# EAGLE design lcd_backpack_v1 (EAGLE 5.07)
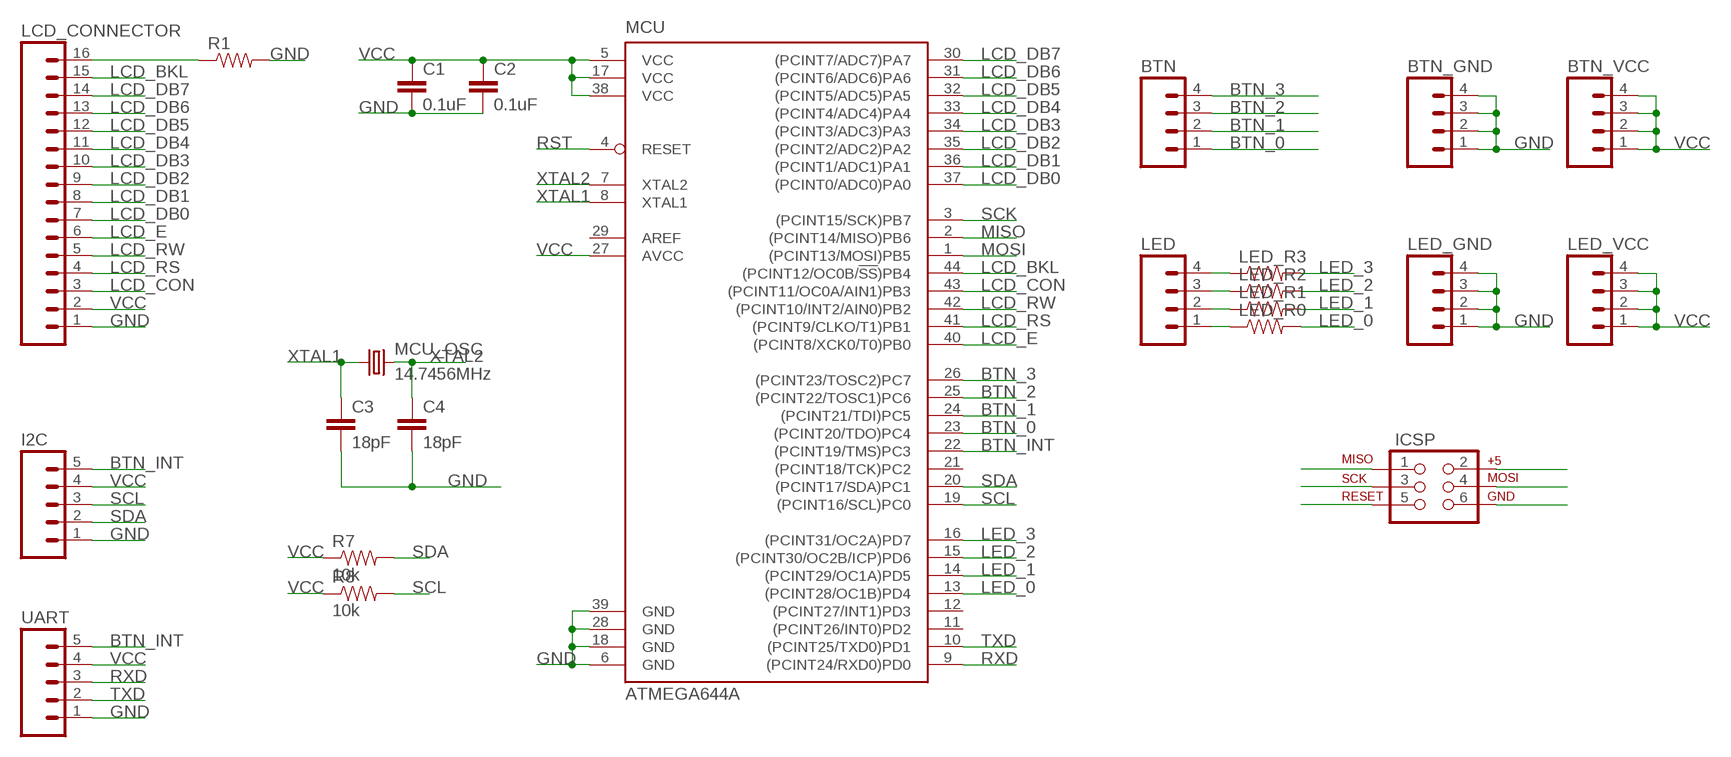
[diagram p0: schematic, sheet 1]

## Parts
BTN  M04PTH  [1X04]
BTN_GND  M04PTH  [1X04]
BTN_VCC  M04PTH  [1X04]
C1  0.1uF  CAP0603-CAP  [0603-CAP]
C2  0.1uF  CAP0603-CAP  [0603-CAP]
C3  18pF  CAP0603-CAP  [0603-CAP]
C4  18pF  CAP0603-CAP  [0603-CAP]
I2C  M05PTH  [1X05]
ICSP  AVR_SPI_PRG_6PTH  [2X3]
LCD_CONNECTOR  M16LONGPADS  [1X16_LONGPADS]
LED  M04PTH  [1X04]
LED_GND  M04PTH  [1X04]
LED_R0  RESISTOR0603-RES  [0603-RES]
LED_R1  RESISTOR0603-RES  [0603-RES]
LED_R2  RESISTOR0603-RES  [0603-RES]
LED_R3  RESISTOR0603-RES  [0603-RES]
LED_VCC  M04PTH  [1X04]
MCU  ATMEGA644A  [TQFP44]
MCU_OSC  14.7456MHz  CRYSTAL5X3  [CRYSTAL-SMD-5X3]
R1  RESISTOR0603-RES  [0603-RES]
R7  10k  RESISTOR0603-RES  [0603-RES]
R8  10k  RESISTOR0603-RES  [0603-RES]
UART  M05PTH  [1X05]

## Nets
BTN_0: BTN.1 MCU.23((PCINT20/TDO)PC4)
BTN_1: BTN.2 MCU.24((PCINT21/TDI)PC5)
BTN_2: BTN.3 MCU.25((PCINT22/TOSC1)PC6)
BTN_3: BTN.4 MCU.26((PCINT23/TOSC2)PC7)
BTN_INT: I2C.5 MCU.22((PCINT19/TMS)PC3) UART.5
GND [supply]: BTN_GND.1 BTN_GND.2 BTN_GND.3 BTN_GND.4 C1.2 C2.2 C3.2 C4.2 I2C.1 ICSP.6 LCD_CONNECTOR.1 LED_GND.1 LED_GND.2 LED_GND.3 LED_GND.4 MCU.6(GND) MCU.18(GND) MCU.28(GND) MCU.39(GND) R1.2 UART.1
LCD_BKL: LCD_CONNECTOR.15 MCU.44((PCINT12/OC0B/!SS!)PB4)
LCD_CON: LCD_CONNECTOR.3 MCU.43((PCINT11/OC0A/AIN1)PB3)
LCD_DB0: LCD_CONNECTOR.7 MCU.37((PCINT0/ADC0)PA0)
LCD_DB1: LCD_CONNECTOR.8 MCU.36((PCINT1/ADC1)PA1)
LCD_DB2: LCD_CONNECTOR.9 MCU.35((PCINT2/ADC2)PA2)
LCD_DB3: LCD_CONNECTOR.10 MCU.34((PCINT3/ADC3)PA3)
LCD_DB4: LCD_CONNECTOR.11 MCU.33((PCINT4/ADC4)PA4)
LCD_DB5: LCD_CONNECTOR.12 MCU.32((PCINT5/ADC5)PA5)
LCD_DB6: LCD_CONNECTOR.13 MCU.31((PCINT6/ADC6)PA6)
LCD_DB7: LCD_CONNECTOR.14 MCU.30((PCINT7/ADC7)PA7)
LCD_E: LCD_CONNECTOR.6 MCU.40((PCINT8/XCK0/T0)PB0)
LCD_RS: LCD_CONNECTOR.4 MCU.41((PCINT9/CLKO/T1)PB1)
LCD_RW: LCD_CONNECTOR.5 MCU.42((PCINT10/INT2/AIN0)PB2)
LED_0: LED_R0.2 MCU.13((PCINT28/OC1B)PD4)
LED_1: LED_R1.2 MCU.14((PCINT29/OC1A)PD5)
LED_2: LED_R2.2 MCU.15((PCINT30/OC2B/ICP)PD6)
LED_3: LED_R3.2 MCU.16((PCINT31/OC2A)PD7)
MISO: ICSP.1 MCU.2((PCINT14/MISO)PB6)
MOSI: ICSP.4 MCU.1((PCINT13/MOSI)PB5)
N$1: LED.1 LED_R0.1
N$2: LED.2 LED_R1.1
N$3: LED.3 LED_R2.1
N$4: LED.4 LED_R3.1
N$9: LCD_CONNECTOR.16 R1.1
RST: ICSP.5 MCU.4(RESET)
RXD: MCU.9((PCINT24/RXD0)PD0) UART.3
SCK: ICSP.3 MCU.3((PCINT15/SCK)PB7)
SCL: I2C.3 MCU.19((PCINT16/SCL)PC0) R8.2
SDA: I2C.2 MCU.20((PCINT17/SDA)PC1) R7.2
TXD: MCU.10((PCINT25/TXD0)PD1) UART.2
VCC [supply]: BTN_VCC.1 BTN_VCC.2 BTN_VCC.3 BTN_VCC.4 C1.1 C2.1 I2C.4 ICSP.2 LCD_CONNECTOR.2 LED_VCC.1 LED_VCC.2 LED_VCC.3 LED_VCC.4 MCU.5(VCC) MCU.17(VCC) MCU.27(AVCC) MCU.38(VCC) R7.1 R8.1 UART.4
XTAL1: C3.1 MCU.8(XTAL1) MCU_OSC.1
XTAL2: C4.1 MCU.7(XTAL2) MCU_OSC.3
Unconnected: MCU.11((PCINT26/INT0)PD2) MCU.12((PCINT27/INT1)PD3) MCU.21((PCINT18/TCK)PC2) MCU.29(AREF)

## Library data of the parts
BTN BTN_GND BTN_VCC LED LED_GND LED_VCC = SparkFun:M04: Header 4 Standard 4-pin 0.1" header. Use with straight break away headers (SKU : PRT-00116), right angle break away headers (PRT-00553), swiss pins (PRT-00743), machine pins (PRT-00117), and female headers (PRT-00115). Molex polarized connector foot print use with SKU : PRT-08231 with associated crimp pins and housings.
C1-C4 = SparkFun:CAP: Capacitor Standard 0603 ceramic capacitor, and 0.1" leaded capacitor.
I2C UART = SparkFun:M05: Header 5 Standard 5-pin 0.1" header. Use with straight break away headers (SKU : PRT-00116), right angle break away headers (PRT-00553), swiss pins (PRT-00743), machine pins (PRT-00117), and female headers (PRT-00115). Molex polarized connector foot print use with SKU : PRT-08230 with associated crimp pins and housings.
ICSP = SparkFun:AVR_SPI_PRG_6: AVR ISP 6 Pin This is the reduced ISP connector for AVR programming. Common on Arduino. This footprint will take up less PCB space and can be used with a 10-pin to 6-pin adapter such as SKU: BOB-08508
LCD_CONNECTOR = SparkFun:M16
LED_R0 LED_R1-LED_R3 R1 R7 R8 = SparkFun:RESISTOR: Resistor Basic schematic elements and footprints for 0603, 1206, and PTH 1/10th watt (small) resistors.
MCU = atmel:ATMEGA644: 8-bit Microcontroller with 64K Bytes In-System Programmable Flash Source: http://www.atmel.com/dyn/resources/prod_documents/doc2593.pdf
MCU_OSC = SparkFun:CRYSTAL: Crystals Various standard crystals. Proven footprints. Spark Fun Electronics SKU : COM-00534

## Net classes
0 signal: width 0.152 mm
1 supply: width 0.305 mm

## Board
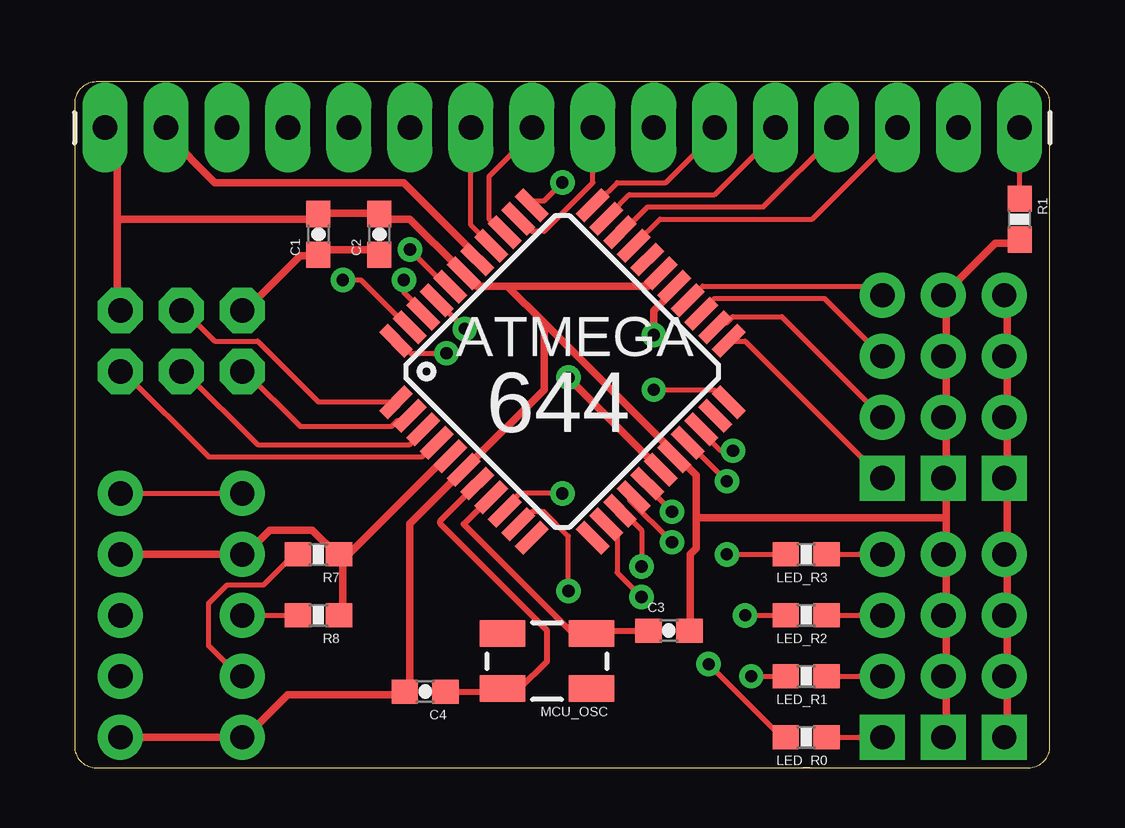
[diagram p1: board, top side]
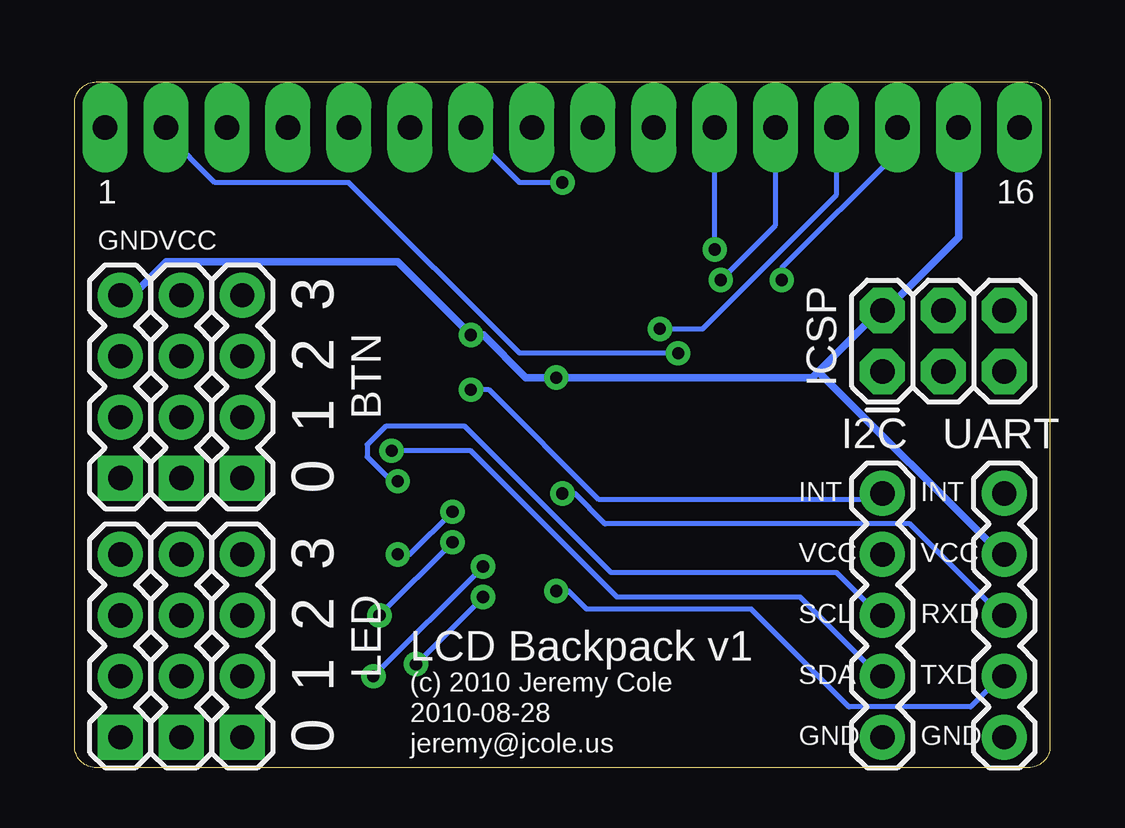
[diagram p2: board, bottom side, seen from below]

Size 40.64 x 28.57 mm. Coordinates in mm from the lower left corner, seen from the top.
Outline: 39.74,0 arc90 40.64,0.9 40.64,27.68 arc90 39.74,28.57 0.9,28.57 arc90 0,27.68 0,0.9 arc90 0.9,0 39.74,0
Copper layers (1*16): Top 0.035mm / dielectric 1.5mm / Bottom 0.035mm
Design rules "SparkFun": minimum track width 8mil, minimum drill 20mil, track to track 8mil, track to pad 8mil, pad to pad 8mil, via to via 8mil, smd to smd 8mil, copper to edge 10mil, drill to drill 8mil, minimum pad ring 12mil, minimum via ring 10mil, stop-mask expansion 4mil, vias tented up to drill 25mil, thermal gap 10mil
tRestrict: area 16.5,2.5 to 22.9,6.3
bRestrict: area 16.5,2.5 to 22.9,6.3

### Footprints (pad centres in the part's own frame; a part is rotated, then mirrored left to right if it is on the bottom)
1X04 = drill 1.016 pad 1.88 square: 1 0,0 | drill 1.016 pad 1.88 round: 2 2.54,0; 3 5.08,0; 4 7.62,0
0603-CAP = smd 1.1 x 1: 1 -0.85,0; 2 0.85,0
1X05 = drill 1.016 pad 1.88 round: 1 0,0; 2 2.54,0; 3 5.08,0; 4 7.62,0; 5 10.16,0
2X3 = drill 1.016 pad 1.88 octagon: 1 0,0; 2 0,2.54; 3 2.54,0; 4 2.54,2.54; 5 5.08,0; 6 5.08,2.54
1X16_LONGPADS = drill 1.016 pad 1.88 long: 1 0,0; 2 2.54,0; 3 5.08,0; 4 7.62,0; 5 10.16,0; 6 12.7,0; 7 15.24,0; 8 17.78,0; 9 20.32,0; 10 22.86,0; 11 25.4,0; 12 27.94,0; 13 30.48,0; 14 33.02,0; 15 35.56,0; 16 38.1,0
0603-RES = smd 1.1 x 1: 1 -0.85,0; 2 0.85,0
TQFP44 = smd 1.5 x 0.5: 1 -5.8,4; 2 -5.8,3.2; 3 -5.8,2.4; 4 -5.8,1.6; 5 -5.8,0.8; 6 -5.8,0; 7 -5.8,-0.8; 8 -5.8,-1.6; 9 -5.8,-2.4; 10 -5.8,-3.2; 11 -5.8,-4; 23 5.8,-4; 24 5.8,-3.2; 25 5.8,-2.4; 26 5.8,-1.6; 27 5.8,-0.8; 28 5.8,0; 29 5.8,0.8; 30 5.8,1.6; 31 5.8,2.4; 32 5.8,3.2; 33 5.8,4 | smd 0.5 x 1.5: 12 -4,-5.8; 13 -3.2,-5.8; 14 -2.4,-5.8; 15 -1.6,-5.8; 16 -0.8,-5.8; 17 0,-5.8; 18 0.8,-5.8; 19 1.6,-5.8; 20 2.4,-5.8; 21 3.2,-5.8; 22 4,-5.8; 34 4,5.8; 35 3.2,5.8; 36 2.4,5.8; 37 1.6,5.8; 38 0.8,5.8; 39 0,5.8; 40 -0.8,5.8; 41 -1.6,5.8; 42 -2.4,5.8; 43 -3.2,5.8; 44 -4,5.8
CRYSTAL-SMD-5X3 = smd 1.9 x 1.1: 1 -1.85,-1.15; 2 1.85,-1.15; 3 1.85,1.15; 4 -1.85,1.15

### Placement (x,y rotation side)
BTN  33.66,12.06 90 bottom
BTN_GND  36.2,12.06 90 bottom
BTN_VCC  38.73,12.06 90 bottom
C1  10.16,22.23 90 top
C2  12.7,22.23 90 top
C3  24.77,5.71 0 top
C4  14.61,3.17 180 top
I2C  6.99,1.27 90 bottom
ICSP  6.99,16.51 0 bottom
LCD_CONNECTOR  1.27,26.67 0 top
LED  33.66,1.27 90 bottom
LED_GND  36.2,1.27 90 bottom
LED_R0  30.48,1.27 180 top
LED_R1  30.48,3.81 180 top
LED_R2  30.48,6.35 180 top
LED_R3  30.48,8.89 180 top
LED_VCC  38.73,1.27 90 bottom
MCU  20.32,16.51 45 top
MCU_OSC  19.68,4.45 180 top
R1  39.37,22.86 270 top
R7  10.16,8.89 180 top
R8  10.16,6.35 180 top
UART  1.91,1.27 90 bottom

### Tracks (layer width: path | path; a pad name or v marks a point on that pad's centre or on a via)
BTN_0
  Top 0.203: MCU.23 27.43,17.78 27.94,17.78 BTN.1
BTN_1
  Top 0.203: MCU.24 26.92,18.54 27.18,18.54 27.43,18.8 29.46,18.8 BTN.2
BTN_2
  Top 0.203: MCU.25 26.16,19.05 26.67,19.56 31.24,19.56 BTN.3
BTN_3
  Top 0.203: MCU.26 25.65,19.56 26.16,20.07 33.27,20.07 BTN.4
BTN_INT  (via drill 0.51)
  Top 0.203: v24.13,15.75 26.67,15.75 27.18,15.24 MCU.22 | UART.5 I2C.5
  Bottom 0.203: v24.13,15.75 23.37,15.75 18.8,11.18 7.37,11.18 7.11,11.43 I2C.5
GND
  Top 0.305: UART.1 I2C.1 7.11,1.27 8.89,3.05 13.72,3.05 C4.2 13.97,3.3 13.97,10.16 MCU.6 19.56,15.75 19.56,18.54 | 36.32,3.81 36.32,1.27 LED_GND.1 | 36.32,8.89 36.32,6.35 | 36.32,6.35 36.32,3.81 | 36.32,3.81 LED_GND.2 | 36.32,6.35 LED_GND.3 | R1.2 39.37,21.84 38.35,21.84 BTN_GND.4 36.32,19.56 36.32,17.27 BTN_GND.3 36.32,17.02 36.32,14.73 BTN_GND.2 36.32,14.48 36.32,12.19 BTN_GND.1 36.32,11.94 36.32,10.41 | 36.32,10.41 36.32,8.89 | 36.32,8.89 LED_GND.4 | 1.78,22.86 1.78,26.16 LCD_CONNECTOR.1 | 1.78,22.86 1.78,19.05 ICSP.6 | 25.91,10.41 25.91,12.19 25.15,12.95 MCU.18 24.89,13.21 19.56,18.54 | 25.91,10.41 25.91,9.14 25.65,8.89 25.65,5.84 C3.2 | 18.03,20.07 16.76,20.07 16.26,20.57 MCU.39 16,20.83 13.97,22.86 12.7,22.86 C2.2 12.7,23.11 10.16,23.11 C1.2 10.16,22.86 1.78,22.86 | 18.03,20.07 23.88,20.07 MCU.28 | 19.56,18.54 18.03,20.07 | 25.91,10.41 36.32,10.41
LCD_BKL  (via drill 0.51)
  Top 0.203: v15.49,17.27 13.97,17.27 13.46,17.78 MCU.44
  Bottom 0.203: v15.49,17.27 22.1,17.27 29.21,24.38 34.8,24.38 36.83,26.42 LCD_CONNECTOR.15
LCD_CON  (via drill 0.51)
  Top 0.203: v11.18,20.32 11.94,20.32 13.72,18.54 MCU.43
  Bottom 0.203: v11.18,20.32 11.18,20.83 6.35,25.65 LCD_CONNECTOR.3
LCD_DB0
  Top 0.203: LCD_CONNECTOR.7 16.51,22.61 17.27,21.84 MCU.37
LCD_DB1
  Top 0.203: LCD_CONNECTOR.8 19.05,26.42 17.27,24.64 17.27,22.86 17.78,22.35 MCU.36
LCD_DB2
  Top 0.203: LCD_CONNECTOR.9 21.59,24.38 19.56,22.35 19.05,22.35 18.54,22.86 MCU.35
LCD_DB3  (via drill 0.51)
  Top 0.203: v20.32,24.38 19.56,23.62 19.05,23.62 MCU.34
  Bottom 0.203: v20.32,24.38 22.1,24.38 24.13,26.42 LCD_CONNECTOR.10
LCD_DB4
  Top 0.203: LCD_CONNECTOR.11 26.67,26.42 24.64,24.38 22.61,24.38 21.84,23.62 MCU.33
LCD_DB5
  Top 0.203: LCD_CONNECTOR.12 29.21,26.42 26.67,23.88 23.11,23.88 22.35,23.11 MCU.32
LCD_DB6
  Top 0.203: LCD_CONNECTOR.13 31.75,26.42 28.7,23.37 23.88,23.37 22.86,22.35 MCU.31
LCD_DB7
  Top 0.203: LCD_CONNECTOR.14 34.29,26.42 30.73,22.86 24.38,22.86 23.37,21.84 MCU.30
LCD_E  (via drill 0.51)
  Top 0.203: v13.97,21.59 15.49,20.07 MCU.40
  Bottom 0.203: v13.97,21.59 LCD_CONNECTOR.6
LCD_RS  (via drill 0.51)
  Top 0.203: v16.26,18.29 15.24,19.3 MCU.41
  Bottom 0.203: v16.26,18.29 14.48,18.29 8.89,23.88 LCD_CONNECTOR.4
LCD_RW  (via drill 0.51)
  Top 0.203: v13.72,20.32 13.72,19.81 14.48,19.05 MCU.42
  Bottom 0.203: v13.72,20.32 11.43,22.61 LCD_CONNECTOR.5
LED_0  (via drill 0.51)
  Top 0.203: v26.42,4.32 29.46,1.27 LED_R0.2 | v23.62,7.11 22.61,8.13 22.61,9.65 22.35,9.91 MCU.13
  Bottom 0.203: v23.62,7.11 v26.42,4.32
LED_1  (via drill 0.51)
  Top 0.203: v23.62,8.38 23.62,9.91 22.86,10.67 MCU.14 | v28.19,3.81 LED_R1.2
  Bottom 0.203: v23.62,8.38 v28.19,3.81
LED_2  (via drill 0.51)
  Top 0.203: v24.89,9.4 23.11,11.18 MCU.15 | v27.94,6.35 LED_R2.2
  Bottom 0.203: v24.89,9.4 v27.94,6.35
LED_3  (via drill 0.51)
  Top 0.203: v24.89,10.67 23.88,11.68 MCU.16 | v27.18,8.89 LED_R3.2
  Bottom 0.203: v27.18,8.89 26.67,8.89 v24.89,10.67
MISO
  Top 0.203: MCU.2 13.72,14.48 13.46,14.48 13.21,14.22 9.4,14.22 7.11,16.51 ICSP.1
MOSI
  Top 0.203: MCU.1 13.21,15.24 10.16,15.24 7.62,17.78 5.84,17.78 4.57,19.05 ICSP.4
N$1
  Top 0.203: LED_R0.1 LED.1
N$2
  Top 0.203: LED_R1.1 LED.2
N$3
  Top 0.203: LED_R2.1 LED.3
N$4
  Top 0.203: LED_R3.1 LED.4
N$9
  Top 0.203: R1.1 LCD_CONNECTOR.16
RST
  Top 0.203: MCU.4 14.99,13.46 14.48,12.95 5.59,12.95 2.03,16.51 ICSP.5
RXD  (via drill 0.51)
  Top 0.203: v20.32,11.43 18.54,11.43 18.03,10.92 MCU.9
  Bottom 0.203: v20.32,11.43 19.81,11.43 18.54,10.16 5.84,10.16 2.03,6.35 UART.3
SCK
  Top 0.203: MCU.3 14.48,13.97 13.97,13.46 7.62,13.46 4.57,16.51 ICSP.3
SCL  (via drill 0.51)
  Top 0.203: I2C.3 R8.2 | v27.18,11.94 25.65,13.46 MCU.19
  Bottom 0.203: v27.18,11.94 27.43,11.94 28.45,12.95 28.45,13.46 27.69,14.22 24.38,14.22 18.29,8.13 8.89,8.13 7.11,6.35 I2C.3
SDA  (via drill 0.51)
  Top 0.203: R7.2 9.14,8.89 7.87,7.62 6.35,7.62 5.59,6.86 5.59,5.08 6.86,3.81 I2C.2 | v27.43,13.21 26.92,13.21 26.16,13.97 MCU.20
  Bottom 0.203: v27.43,13.21 24.13,13.21 18.03,7.11 10.41,7.11 7.11,3.81 I2C.2
TXD  (via drill 0.51)
  Top 0.203: v20.57,7.37 20.57,9.65 19.56,10.67 19.05,10.67 18.54,10.16 MCU.10
  Bottom 0.203: v20.57,7.37 20.07,7.37 19.3,6.6 12.45,6.6 8.38,2.54 3.3,2.54 2.03,3.81 UART.2
VCC  (via drill 0.51)
  Top 0.305: 38.86,3.81 38.86,1.27 LED_VCC.1 | 38.86,8.89 38.86,6.35 | 38.86,6.35 38.86,3.81 | 38.86,3.81 LED_VCC.2 | 38.86,6.35 LED_VCC.3 | BTN_VCC.4 38.86,19.56 38.86,17.27 BTN_VCC.3 38.86,17.02 38.86,14.73 BTN_VCC.2 38.86,14.48 38.86,12.19 BTN_VCC.1 38.86,11.94 38.86,8.89 | 38.86,8.89 LED_VCC.4 | LCD_CONNECTOR.2 3.81,26.42 5.84,24.38 13.72,24.38 16.76,21.34 MCU.38 | 11.18,8.64 11.18,8.89 R7.1 | 11.18,8.64 11.18,6.35 R8.1 | 11.18,8.64 15.49,12.95 MCU.5 | R7.1 11.18,8.64 | UART.4 I2C.4 7.11,8.89 8.13,9.91 9.91,9.91 10.92,8.89 R7.1 | C2.1 12.7,21.59 10.16,21.59 C1.1 10.16,21.34 9.4,21.34 7.11,19.05 ICSP.2 | v20.57,16.26 24.38,12.45 MCU.17 | v24.13,18.03 24.13,19.05 24.89,19.81 MCU.27
  Bottom 0.305: 9.65,16.51 7.11,19.05 ICSP.2 6.86,19.05 3.81,22.1 LCD_CONNECTOR.2 | 9.65,16.51 9.91,16.26 v20.57,16.26 21.84,16.26 23.62,18.03 v24.13,18.03 27.18,21.08 36.83,21.08 38.1,19.81 38.61,19.81 BTN_VCC.4 | 9.65,16.51 2.03,8.89 UART.4
XTAL1
  Top 0.254: C3.1 21.66,5.71 MCU_OSC.1 20.76,5.59 16.19,10.16 16.23,10.16 MCU.8
XTAL2
  Top 0.254: C4.1 17.71,3.17 MCU_OSC.3 18.54,3.29 19.68,4.45 19.68,5.71 15.24,10.16 15.24,10.3 MCU.7

### Text on the board
tNames: ATMEGA | 644
bNames: 16 | 1 | VCC | GND | 3 | 2 | 1 | INT | INT | 0 | VCC | VCC | 3 | RXD | SCL | 2 | LCD Backpack v1 | TXD | SDA | (c) 2010 Jeremy Cole | 1 | 2010-08-28 | GND | GND | jeremy@jcole.us | 0